# Altium schematic sheet MCU_REVB_1.SchDoc: Big-MCU
size 270 x 228 mm; Origin: Eagle; Date: 2023-01-13 8:42:14 AM; SheetNumber: 2; GateName_1: G$1; SymbolName_1: LETTER_L; LibraryName: frames; DeviceSetName: LETTER_L; GateName_2: G$2; SymbolName_2: DOCFIELD; Sheet: Sheet:; REV: REV:
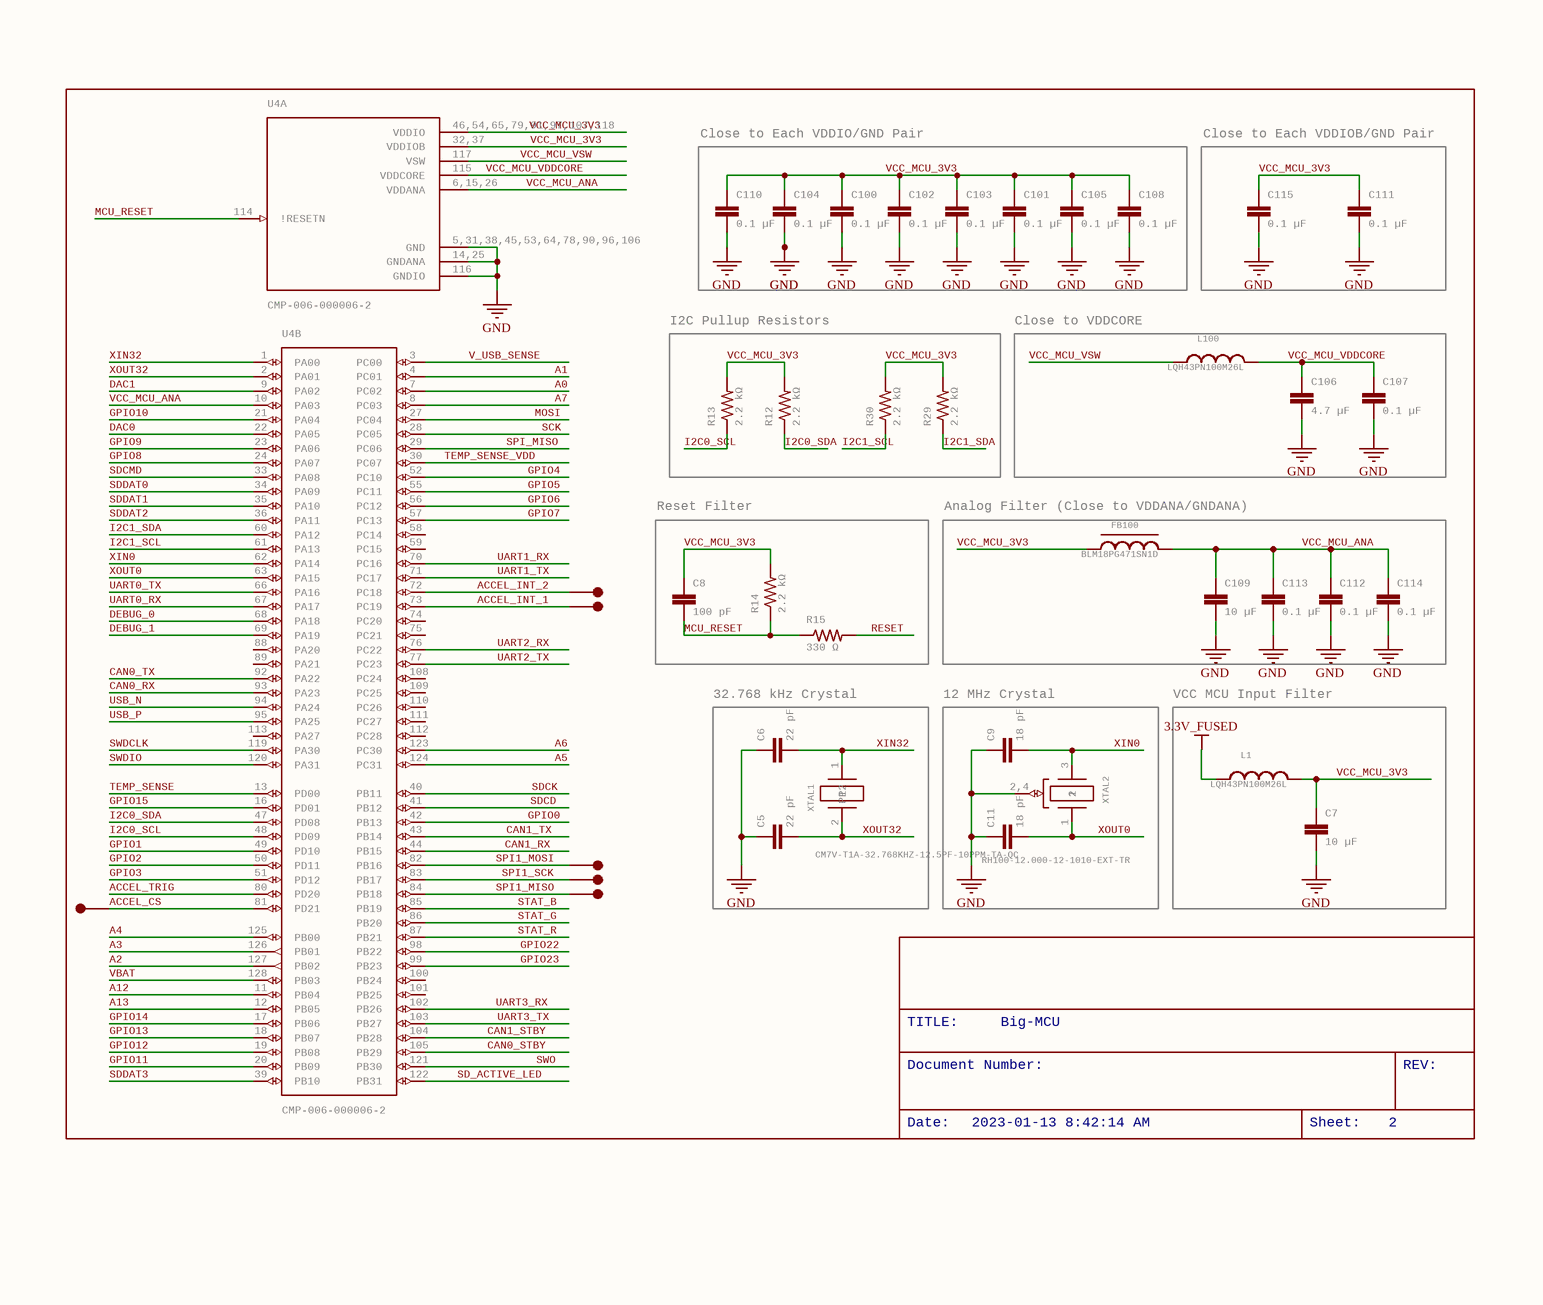
[diagram p0: MCU_REVB_1.SchDoc]

## Parts
C5  22 pF  [C0805]
C6  22 pF  [C0805]
C7  10 µF  [C1206]
C8  100 pF  [C0805]
C9  18 pF  [C0805]
C11  18 pF  [C0805]
C100  0.1 µF  [C0805]
C101  0.1 µF  [C0805]
C102  0.1 µF  [C0805]
C103  0.1 µF  [C0805]
C104  0.1 µF  [C0805]
C105  0.1 µF  [C0805]
C106  4.7 µF  [C0805]
C107  0.1 µF  [C0805]
C108  0.1 µF  [C0805]
C109  10 µF  [C1206]
C110  0.1 µF  [C0805]
C111  0.1 µF  [C0805]
C112  0.1 µF  [C0805]
C113  0.1 µF  [C0805]
C114  0.1 µF  [C0805]
C115  0.1 µF  [C0805]
FB100  BLM18PG471SN1D  [FP-BLM18-0_15-t0_8-MFG]
L1  LQH43PN100M26L  [LQH43PN100M26L]
L100  LQH43PN100M26L  [LQH43PN100M26L]
R12  2.2 kΩ  [6-0805_N]
R13  2.2 kΩ  [6-0805_N]
R14  2.2 kΩ  [6-0805_N]
R15  330 Ω  [6-0805_N]
R29  2.2 kΩ  [6-0805_N]
R30  2.2 kΩ  [6-0805_N]
TP11  5015  [KEYSTONE_5015]  (value not drawn)
TP12  5015  [KEYSTONE_5015]  (value not drawn)
TP13  5015  [KEYSTONE_5015]  (value not drawn)
TP14  5015  [KEYSTONE_5015]  (value not drawn)
TP15  5015  [KEYSTONE_5015]  (value not drawn)
TP16  5015  [KEYSTONE_5015]  (value not drawn)
U4  CMP-006-000006-2  [FP-MG-IPC_A]  (parts A,B of 2)
XTAL1  CM7V-T1A-32.768KHZ-12.5PF-10PPM-TA-QC  [DFN245P320X65-2N]
XTAL2  RH100-12.000-12-1010-EXT-TR  [SON160P320X80-4N]

## Blocks framed on the sheet
Close to Each VDDIO/GND Pair: C100-C105 C108 C110
Close to Each VDDIOB/GND Pair: C111 C115
I2C Pullup Resistors: R12 R13 R29 R30
Close to VDDCORE: C106 C107 L100
Reset Filter: C8 R14 R15
Analog Filter (Close to VDDANA/GNDANA): C109 C112-C114 FB100
32.768 kHz Crystal: C5 C6 XTAL1
12 MHz Crystal: C9 C11 XTAL2
VCC MCU Input Filter: C7 L1

## Nets
3.3V_FUSED: L1.1
GND: C5.1 C6.1 C7.2 C9.1 C11.1 C100.2 C101.2 C102.2 C103.2 C104.2 C105.2 C106.2 C107.2 C108.2 C109.2 C110.2 C111.2 C112.2 C113.2 C114.2 C115.2 U4.5,31,38,45,53,64,78,90,96,106(GND) U4.14,25(GNDANA) U4.116(GNDIO) XTAL2.2,4
A0: U4.7(PC02)
A1: U4.4(PC01)
A2: U4.127(PB02)
A3: U4.126(PB01)
A4: U4.125(PB00)
A5: U4.124(PC31)
A6: U4.123(PC30)
A7: U4.8(PC03)
A12: U4.11(PB04)
A13: U4.12(PB05)
ACCEL_CS: TP15.1(TP) U4.81(PD21)
ACCEL_INT_1: TP11.1(TP) U4.73(PC19)
ACCEL_INT_2: TP13.1(TP) U4.72(PC18)
ACCEL_TRIG: U4.80(PD20)
CAN0_RX: U4.93(PA23)
CAN0_STBY: U4.105(PB29)
CAN0_TX: U4.92(PA22)
CAN1_RX: U4.44(PB15)
CAN1_STBY: U4.104(PB28)
CAN1_TX: U4.43(PB14)
DAC0: U4.22(PA05)
DAC1: U4.9(PA02)
DEBUG_0: U4.68(PA18)
DEBUG_1: U4.69(PA19)
GPIO0: U4.42(PB13)
GPIO1: U4.49(PD10)
GPIO2: U4.50(PD11)
GPIO3: U4.51(PD12)
GPIO4: U4.52(PC10)
GPIO5: U4.55(PC11)
GPIO6: U4.56(PC12)
GPIO7: U4.57(PC13)
GPIO8: U4.24(PA07)
GPIO9: U4.23(PA06)
GPIO10: U4.21(PA04)
GPIO11: U4.20(PB09)
GPIO12: U4.19(PB08)
GPIO13: U4.18(PB07)
GPIO14: U4.17(PB06)
GPIO15: U4.16(PD01)
GPIO22: U4.98(PB22)
GPIO23: U4.99(PB23)
I2C0_SCL: R13.1 U4.48(PD09)
I2C0_SDA: R12.1 U4.47(PD08)
I2C1_SCL: R30.1 U4.61(PA13)
I2C1_SDA: R29.1 U4.60(PA12)
MCU_RESET: C8.2 R14.1 R15.1 U4.114(!RESETN)
MOSI: U4.27(PC04)
RESET: R15.2
SCK: U4.28(PC05)
SD_ACTIVE_LED: U4.122(PB31)
SDCD: U4.41(PB12)
SDCK: U4.40(PB11)
SDCMD: U4.33(PA08)
SDDAT0: U4.34(PA09)
SDDAT1: U4.35(PA10)
SDDAT2: U4.36(PA11)
SDDAT3: U4.39(PB10)
SPI1_MISO: TP16.1(TP) U4.84(PB18)
SPI1_MOSI: TP12.1(TP) U4.82(PB16)
SPI1_SCK: TP14.1(TP) U4.83(PB17)
SPI_MISO: U4.29(PC06)
STAT_B: U4.85(PB19)
STAT_G: U4.86(PB20)
STAT_R: U4.87(PB21)
SWDCLK: U4.119(PA30)
SWDIO: U4.120(PA31)
SWO: U4.121(PB30)
TEMP_SENSE: U4.13(PD00)
TEMP_SENSE_VDD: U4.30(PC07)
UART0_RX: U4.67(PA17)
UART0_TX: U4.66(PA16)
UART1_RX: U4.70(PC16)
UART1_TX: U4.71(PC17)
UART2_RX: U4.76(PC22)
UART2_TX: U4.77(PC23)
UART3_RX: U4.102(PB26)
UART3_TX: U4.103(PB27)
USB_N: U4.94(PA24)
USB_P: U4.95(PA25)
V_USB_SENSE: U4.3(PC00)
VBAT: U4.128(PB03)
VCC_MCU_3V3: C7.1 C8.1 C100.1 C101.1 C102.1 C103.1 C104.1 C105.1 C108.1 C110.1 C111.1 C115.1 FB100.1 L1.2 R12.2 R13.2 R14.2 R29.2 R30.2 U4.32,37(VDDIOB) U4.46,54,65,79,91,97,107,118(VDDIO)
VCC_MCU_ANA: C109.1 C112.1 C113.1 C114.1 FB100.2 U4.6,15,26(VDDANA) U4.10(PA03)
VCC_MCU_VDDCORE: C106.1 C107.1 L100.2 U4.115(VDDCORE)
VCC_MCU_VSW: L100.1 U4.117(VSW)
XIN0: C9.2 U4.62(PA14) XTAL2.3(2)
XIN32: C6.2 U4.1(PA00) XTAL1.1(P1)
XOUT0: C11.2 U4.63(PA15) XTAL2.1
XOUT32: C5.2 U4.2(PA01) XTAL1.2(P2)

Not connected (* = marked no-connect by the designer): U4 58(PC14) 59(PC15) 74(PC20) 75(PC21) 88(PA20) 89(PA21) 100(PB24) 101(PB25) 108(PC24) 109(PC25) 110(PC26) 111(PC27) 112(PC28) 113(PA27)

## Notes on the sheet
- TITLE:
- Big-MCU
- Document Number:
- REV:
- Date:
- 2023-01-13 8:42:14 AM
- Sheet:
- 2

## Library data of the parts
C5 C6 C8 C9 C11 C100-C108 C110-C115 = C-EUC0805: CAPACITOR, European symbol; GateName_1: G$1; SymbolName_1: C-EU; POPULARITY: 88; DeviceName: C0805; LibraryName: rcl; DeviceSetName: C-EU; SPICEPREFIX: C
C7 C109 = C-EUC1206: CAPACITOR, European symbol; GateName_1: G$1; SymbolName_1: C-EU; POPULARITY: 54; DeviceName: C1206; LibraryName: rcl; DeviceSetName: C-EU; SPICEPREFIX: C
FB100 = CMP-006-000008-2: 0603 470Ω ±25% DCR=0.20Ω 1A; GateName_1: G$1; SymbolName_1: FERRITE_BEAD; Value: 200mR; Material: Steel,Ferrite; Impedance: 470R; Number of Circuits: 1; Core Material: Ferrite; Test Frequency: 100MHz; LibraryName: MCU Board; DeviceSetName: BLM18PG471SN1D; Component Type: Standard; Design Item ID: BLM18PG471SN1D; Package: 0603; Pin Count: 2; Source: MCU Board.SCHLIB; Lead Free: Lead Free; Length: 1.6mm; Radiation Hardening: No; DC Current: 1A; Current Rating: 1A; Military Standard: Not; Package Quantity: 1; RoHS Compliant: Yes; Max Operating Temperature: 125°C; DC Resistance (DCR): 200mR; Max Current Rating: 1A; Packaging: Tape and Reel; Termination: SMD/SMT; Case Code (Metric): 1608; Width: 0.8mm; Pins: 2; Height: 0.8mm; Min Operating Temperature: -55°C; Depth: 0.8mm; Series: BLM18P; Number of Lines: 1; DC Resistance-Max: 200mR; Case/Package: 0603; Reach SVHC Compliant: Yes; Tolerance: 25%; Case Code (Imperial): 0603; Max DC Current: 1A
L1 L100 = CMP-004-000001-3: GateName_1: G$1; SymbolName_1: INDUCTOR; LibraryName: MCU Board; DeviceSetName: LQH43PN100M26L; Component Type: Standard; Design Item ID: LQH43PN100M26L; Package: LQH43PN100M26L; Pin Count: 2; Source: MCU Board.SCHLIB
R12-R15 R29 R30 = R-US_R0805: RESISTOR, American symbol; GateName_1: G$1; SymbolName_1: R-US; DeviceName: R0805; DeviceSetName: R-US_; POPULARITY: 85; LibraryName: rcl; SPICEPREFIX: R
TP11-TP16 = CMP-005-000003-3: GateName_1: G$1; MF: Keystone Electronics; SymbolName_1: 5015; LibraryName: MCU Board; DeviceSetName: 5015; AVAILABILITY: Unavailable; MOUSER-PURCHASE-URL: https://snapeda.com/shop?store=Mouser&id=48459; MP: 5015; Package: KEYSTONE_5015; PRICE: None; Component Type: Standard; Design Item ID: 5015; Pin Count: 1; Source: MCU Board.SCHLIB
U4 = CMP-006-000006-2: 120MHZ 1024KB Flash 128 TQFP PKG inTapeNReel 85CTemp 128 TQFP 14x14x1mm T/R RoHS Compliant: Yes; GateName_1: G$1; SymbolName_1: ATSAMD51P20A-AU_SECTION1; GateName_2: G$2; SymbolName_2: ATSAMD51P20A-AU_SECTION2; DeviceSetName: ATSAMD51P20A-AU; MF: Microchip; Interface: I2C,SPI,USB,IrDA,MMC,SD,UART,USART,EBI/EMI; Core Architecture: ARM; Oscillator Type: Internal; Peripherals: Brown-out Detect/Reset,POR,PWM,DMA; Memory Size: 1MB; Number of I/Os: 99; LibraryName: MCU Board; AVAILABILITY: Unavailable; MP: ATSAMD51P20A-AU; Package: QFP40P1600X1600X120-128N; PRICE: None; Source: MCU Board.SCHLIB; Pin Count: 108; Frequency: 120MHz; Case/Package: TQFP; Design Item ID: ATSAMD51P20A-AU; Component Type: Standard; Max Operating Temperature: 85°C; Memory Format: FLASH; Pins: 128; Min Operating Temperature: -40°C; Packaging: Cut Tape
XTAL1 = CMP-006-000011-2: Crystal 32.768KHZ 12.5PF SMD; GateName_1: G$1; SymbolName_1: OSCILLATOR; Frequency Tolerance: 10ppm; ESR: 70kR; LibraryName: MCU Board; DeviceSetName: CM7V-T1A-32.768KHZ-12.5PF-10PPM-TA-QC; Component Type: Standard; Design Item ID: CM7V-T1A-32.768KHZ-12.5PF-10PPM-TA-QC; Package: CM7V-T1A-32.768KHZ-12.5PF-10PPM-TA-QC; Pin Count: 2; Source: MCU Board.SCHLIB; Width: 1.5mm; Mounting Technology: Surface Mount; Height: 0.65mm; Max Operating Temperature: 85°C; Frequency: 32.768kHz; Case/Package: SMD/SMT; Length: 3.2mm; Pins: 2; Min Operating Temperature: -40°C; Load Capacitance: 12.5pF
XTAL2 = CMP-006-000019-2: pin to pad: 2,4>2+4; GateName_1: G$1; SymbolName_1: CRYSTAL_W_GROUND; LibraryName: MCU Board; DeviceSetName: RH100-12.000-12-1010-EXT-TR; Component Type: Standard; Design Item ID: RH100-12.000-12-1010-EXT-TR; Package: RH100-12.000-12-1010-EXT-TR; Pin Count: 3; Source: MCU Board.SCHLIB